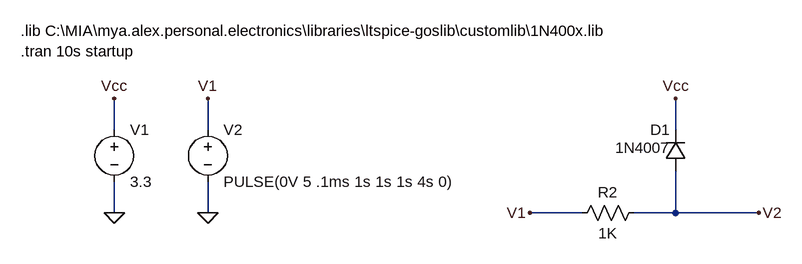
[diagram p0: schematic 5-to-3v3.asc]
5-to-3v3.asc, the LTspice schematic file:
Version 4
SHEET 1 1076 980
WIRE -3120 176 -3120 128
WIRE -2976 176 -2976 128
WIRE -2256 176 -2256 128
WIRE -3120 304 -3120 256
WIRE -2976 304 -2976 256
WIRE -2400 304 -2480 304
WIRE -2256 304 -2256 240
WIRE -2256 304 -2320 304
WIRE -2128 304 -2256 304
FLAG -3120 304 0
FLAG -3120 128 Vcc
FLAG -2256 128 Vcc
FLAG -2976 304 0
FLAG -2976 128 V1
FLAG -2480 304 V1
FLAG -2128 304 V2
SYMBOL voltage -3120 160 R0
WINDOW 123 0 0 Left 0
WINDOW 39 0 0 Left 0
SYMATTR InstName V1
SYMATTR Value 3.3
SYMBOL diode -2240 240 R180
WINDOW 0 24 64 Left 2
WINDOW 3 24 36 Left 2
SYMATTR InstName D1
SYMATTR Value 1N4007
SYMBOL voltage -2976 160 R0
WINDOW 123 0 0 Left 0
WINDOW 39 0 0 Left 0
SYMATTR InstName V2
SYMATTR Value PULSE(0V 5 .1ms 1s 1s 1s 4s 0)
SYMBOL res -2304 288 R90
WINDOW 0 0 56 VBottom 2
WINDOW 3 32 56 VTop 2
SYMATTR InstName R2
SYMATTR Value 1K
TEXT -3264 24 Left 2 !.lib C:\\MIA\\mya.alex.personal.electronics\\libraries\\ltspice-goslib\\customlib\\1N400x.lib\n.tran 10s startup

The netlist it stands for:
* 5-to-3v3.asc
V1 Vcc 0 3.3
D1 V2 Vcc 1N4007
V2 V1 0 PULSE(0V 5 .1ms 1s 1s 1s 4s 0)
R2 V2 V1 1K
.model D D
.lib standard.dio
.lib C:\MIA\mya.alex.personal.electronics\libraries\ltspice-goslib\customlib\1N400x.lib
.tran 10s startup
.backanno
.end